# EAGLE design Main (EAGLE 6.3)
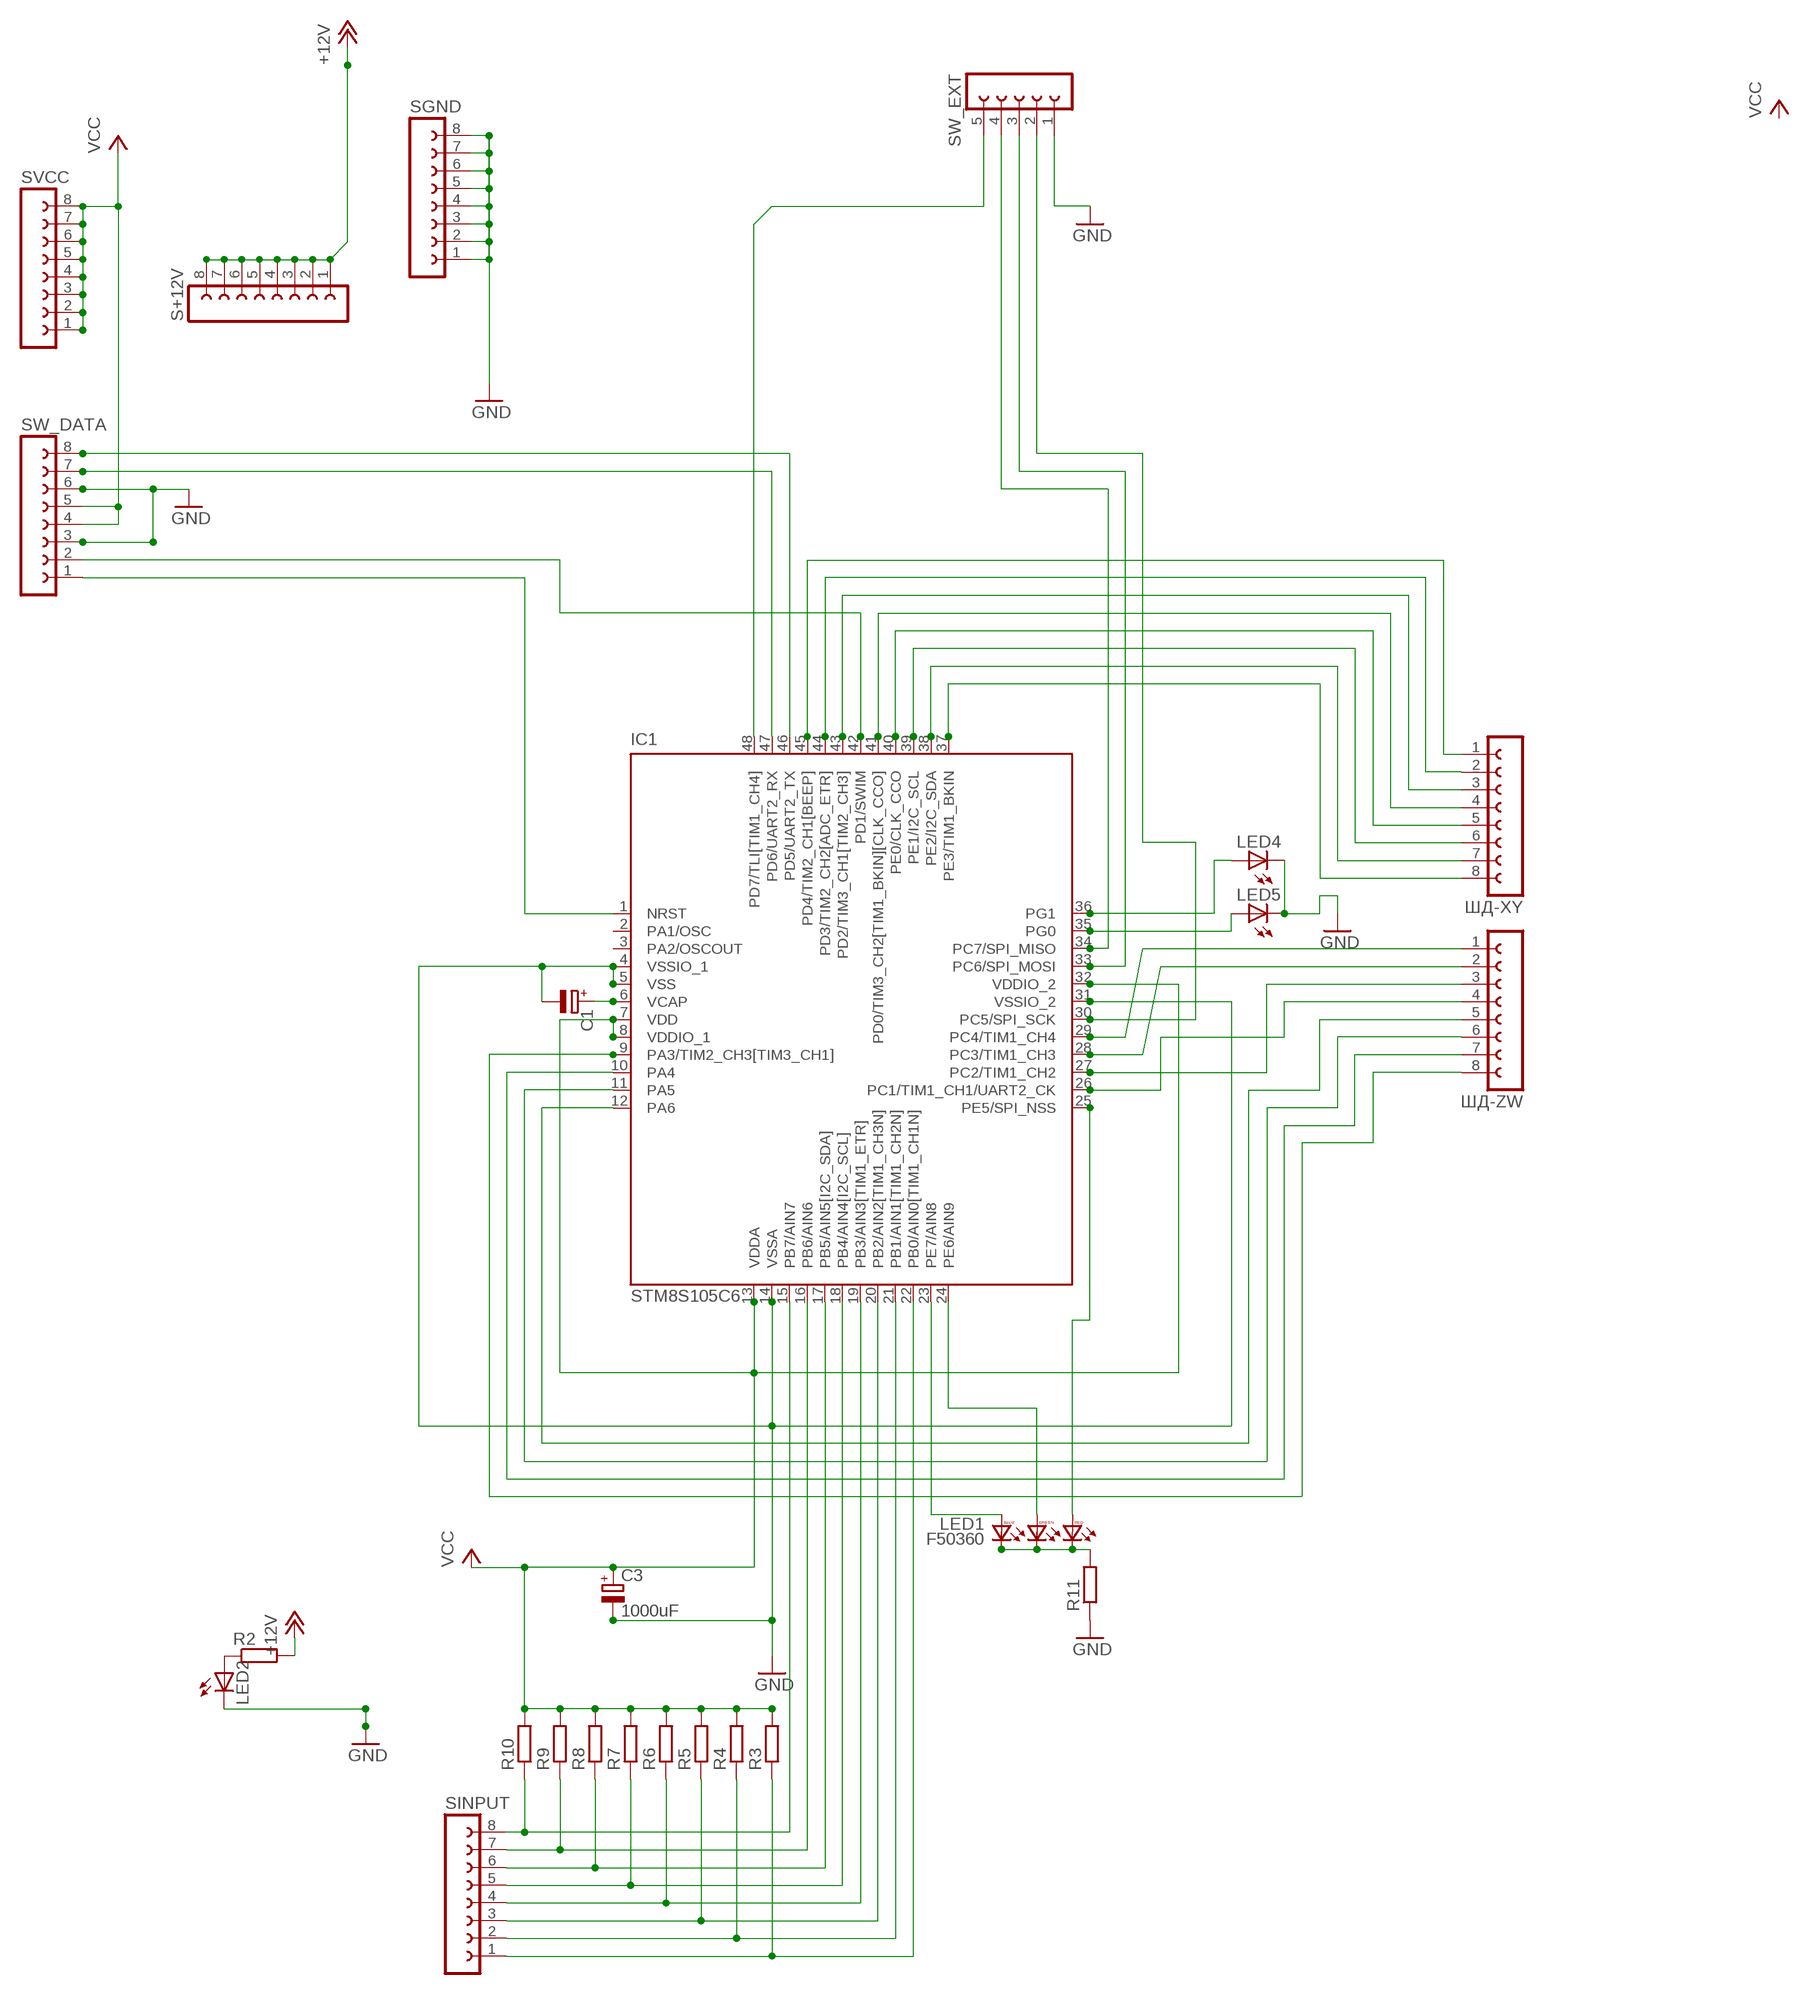
[diagram p0: schematic, sheet 1]

## Parts
C1  CPOL-EUR/2012-12W  [R/2012-12W]
C3  1000uF  CPOL-EUSANYO_9E  [SANYO-OSCON_9E]
IC1  STM8S105C6  [LQFP48-7X7]
LED1  F50360  [F50360]
LED2  LED3MM  [LED3MM]
LED4  LED3MM  [LED3MM]
LED5  LED3MM  [LED3MM]
R2  R-EU_0204/7  [0204/7]
R3  R-EU_M0805  [M0805]
R4  R-EU_M0805  [M0805]
R5  R-EU_M0805  [M0805]
R6  R-EU_M0805  [M0805]
R7  R-EU_M0805  [M0805]
R8  R-EU_M0805  [M0805]
R9  R-EU_M0805  [M0805]
R10  R-EU_M0805  [M0805]
R11  R-EU_0204/7  [0204/7]
S+12V  FE08-1  [FE08]
SGND  FE08-1  [FE08]
SINPUT  FE08-1  [FE08]
SVCC  FE08-1  [FE08]
SW_DATA  FE08-1  [FE08]
SW_EXT  FE05-1  [FE05-1]
ШД-XY  FE08-1  [FE08]
ШД-ZW  FE08-1  [FE08]

## Nets
+12V: R2.2 S+12V.1 S+12V.2 S+12V.3 S+12V.4 S+12V.5 S+12V.6 S+12V.7 S+12V.8
GND: C1.- C3.- IC1.4(VSSIO_1) IC1.5(VSS) IC1.14(VSSA) IC1.31(VSSIO_2) LED2.K(C) LED4.K(C) LED5.K(C) R11.1 SGND.1 SGND.2 SGND.3 SGND.4 SGND.5 SGND.6 SGND.7 SGND.8 SW_DATA.3 SW_DATA.6 SW_EXT.1
IN-Y3: IC1.45(PD4/TIM2_CH1[BEEP]) ШД-XY.1
IN-Y4: IC1.43(PD2/TIM3_CH1[TIM2_CH3]) ШД-XY.3
LED_GND: LED1.BC LED1.GC LED1.RC R11.2
N$1: IC1.22(PB0/AIN0[TIM1_CH1N]) R3.1 SINPUT.1
N$6: IC1.47(PD6/UART2_RX) SW_DATA.7
N$7: C1.+ IC1.6(VCAP)
N$13: IC1.40(PE0/CLK_CCO) ШД-XY.5
N$14: IC1.39(PE1/I2C_SCL) ШД-XY.6
N$15: IC1.38(PE2/I2C_SDA) ШД-XY.7
N$16: IC1.37(PE3/TIM1_BKIN) ШД-XY.8
N$18: IC1.34(PC7/SPI_MISO) SW_EXT.4
N$19: IC1.35(PG0) LED5.A
N$20: IC1.26(PC1/TIM1_CH1/UART2_CK) ШД-ZW.4
N$21: IC1.9(PA3/TIM2_CH3[TIM3_CH1]) ШД-ZW.8
N$22: IC1.27(PC2/TIM1_CH2) ШД-ZW.3
N$23: IC1.11(PA5) ШД-ZW.6
N$24: IC1.12(PA6) ШД-ZW.5
N$25: IC1.28(PC3/TIM1_CH3) ШД-ZW.2
N$26: IC1.41(PD0/TIM3_CH2[TIM1_BKIN][CLK_CCO]) ШД-XY.4
N$27: IC1.29(PC4/TIM1_CH4) ШД-ZW.1
N$28: IC1.30(PC5/SPI_SCK) SW_EXT.2
N$29: IC1.36(PG1) LED4.A
N$35: IC1.21(PB1/AIN1[TIM1_CH2N]) R4.1 SINPUT.2
N$36: IC1.20(PB2/AIN2[TIM1_CH3N]) R5.1 SINPUT.3
N$38: IC1.19(PB3/AIN3[TIM1_ETR]) R6.1 SINPUT.4
N$41: IC1.18(PB4/AIN4[I2C_SCL]) R7.1 SINPUT.5
N$42: IC1.17(PB5/AIN5[I2C_SDA]) R8.1 SINPUT.6
N$43: IC1.16(PB6/AIN6) R9.1 SINPUT.7
N$44: IC1.15(PB7/AIN7) R10.1 SINPUT.8
N$46: IC1.23(PE7/AIN8) LED1.BA
N$47: IC1.24(PE6/AIN9) LED1.GA
N$48: IC1.25(PE5/SPI_NSS) LED1.RA
N$49: IC1.48(PD7/TLI[TIM1_CH4]) SW_EXT.5
N$50: IC1.33(PC6/SPI_MOSI) SW_EXT.3
N$52: IC1.10(PA4) ШД-ZW.7
N$54: IC1.44(PD3/TIM2_CH2[ADC_ETR]) ШД-XY.2
N$60: LED2.A R2.1
RST: IC1.1(NRST) SW_DATA.1
SWD: IC1.42(PD1/SWIM) SW_DATA.2
TXD: IC1.46(PD5/UART2_TX) SW_DATA.8
VCC: C3.+ IC1.7(VDD) IC1.8(VDDIO_1) IC1.13(VDDA) IC1.32(VDDIO_2) R3.2 R4.2 R5.2 R6.2 R7.2 R8.2 R9.2 R10.2 SVCC.1 SVCC.2 SVCC.3 SVCC.4 SVCC.5 SVCC.6 SVCC.7 SVCC.8 SW_DATA.4 SW_DATA.5
Unconnected: IC1.2(PA1/OSC) IC1.3(PA2/OSCOUT)

## Library data of the parts
C1 = resistor:CPOL-EU: POLARIZED CAPACITOR, European symbol
C3 = rcl:CPOL-EU: POLARIZED CAPACITOR, European symbol
IC1 = st-microelectronics:STM8S105C: Access line, 16 MHz STM8S 8-bit MCU up to 32 Kbytes Flash, integrated EEPROM,10-bit ADC, timers, UART, SPI, I²C Source: Data sheet <http://www.st.com/stonline/products/literature/ds/14771/stm8s105c4.pdf>; MPN: STM8S105C6T6; OC_FARNELL: 1706222; OC_NEWARK: 09R6033
LED1 = led:F50360: Full color Z-Power LED RGB P5-II Series Source: http://www.seoulsemicon.co.kr .. F50360.pdf
LED2 LED4 LED5 = led:LED: LED OSRAM: - CHIPLED LG R971, LG N971, LY N971, LG Q971, LY Q971, LO R971, LY R971 LH N974, LH R974 LS Q976, LO Q976, LY Q976 LO Q996 - Hyper CHIPLED LW Q18S LB Q993, LB Q99A, LB R99A - SideLED LS A670, LO A670, LY A670, LG A670, LP A670 LB A673, LV A673, LT A673, LW A673 LH A674 LY A675 LS A676, LA A676, LO A676, LY A676, LW A676 LS A679, LY A679, LG A679 - Hyper Micro SIDELED® LS Y876, LA Y876, LO Y876, LY Y876 LT Y87S - SmartLED LW L88C, LW L88S LB L89C, LB L89S, LG L890 LS L89K, LO L89K, LY L89K LS L896, LA L896, LO L896, LY L896 - TOPLED LS T670, LO T670, LY T670, LG T670, LP T670 LSG T670, LSP T670, LSY T670, LOP T670, LYG T670 LG T671, LOG T671, LSG T671 LB T673, LV T673, LT T673, LW T673 LH T674 LS T676, LA T676, LO T676, LY T676, LB T676, LH T676, LSB T676, LW T676 LB T67C, LV T67C, LT T67C, LS T67K, LO T67K, LY T67K, LW E67C LS E67B, LA E67B, LO E67B, LY E67B, LB E67C, LV E67C, LT E67C LW T67C LS T679, LY T679, LG T679 LS T770, LO T770, LY T770, LG T770, LP T770 LB T773, LV T773, LT T773, LW T773 LH T774 LS E675, LA E675, LY E675, LS T675 LS T776, LA T776, LO T776, LY T776, LB T776 LHGB T686 LT T68C, LB T68C - Hyper Mini TOPLED® LB M676 - Mini TOPLED Santana® LG M470 LS M47K, LO M47K, LY M47K Source: http://www.osram.convergy.de LUXEON: - LUMILED® LXK2-PW12-R00, LXK2-PW12-S00, LXK2-PW14-U00, LXK2-PW14-V00 LXK2-PM12-R00, LXK2-PM12-S00, LXK2-PM14-U00 LXK2-PE12-Q00, LXK2-PE12-R00, LXK2-PE12-S00, LXK2-PE14-T00, LXK2-PE14-U00 LXK2-PB12-K00, LXK2-PB12-L00, LXK2-PB12-M00, LXK2-PB14-N00, LXK2-PB14-P00, LXK2-PB14-Q00 LXK2-PR12-L00, LXK2-PR12-M00, LXK2-PR14-Q00, LXK2-PR14-R00 LXK2-PD12-Q00, LXK2-PD12-R00, LXK2-PD12-S00 LXK2-PH12-R00, LXK2-PH12-S00 LXK2-PL12-P00, LXK2-PL12-Q00, LXK2-PL12-R00 Source: www.luxeon.com KINGBRIGHT: KA-3528ASYC Source: www.kingbright.com
R2-R11 = resistor:R-EU_: RESISTOR, European symbol
S+12V SGND SINPUT SVCC SW_DATA ШД-XY ШД-ZW = con-lsta:FE08-1: FEMALE HEADER; OC_FARNELL: unknown; OC_NEWARK: unknown
SW_EXT = con-lsta:FE05-1: FEMALE HEADER; OC_FARNELL: unknown; OC_NEWARK: unknown

## Board
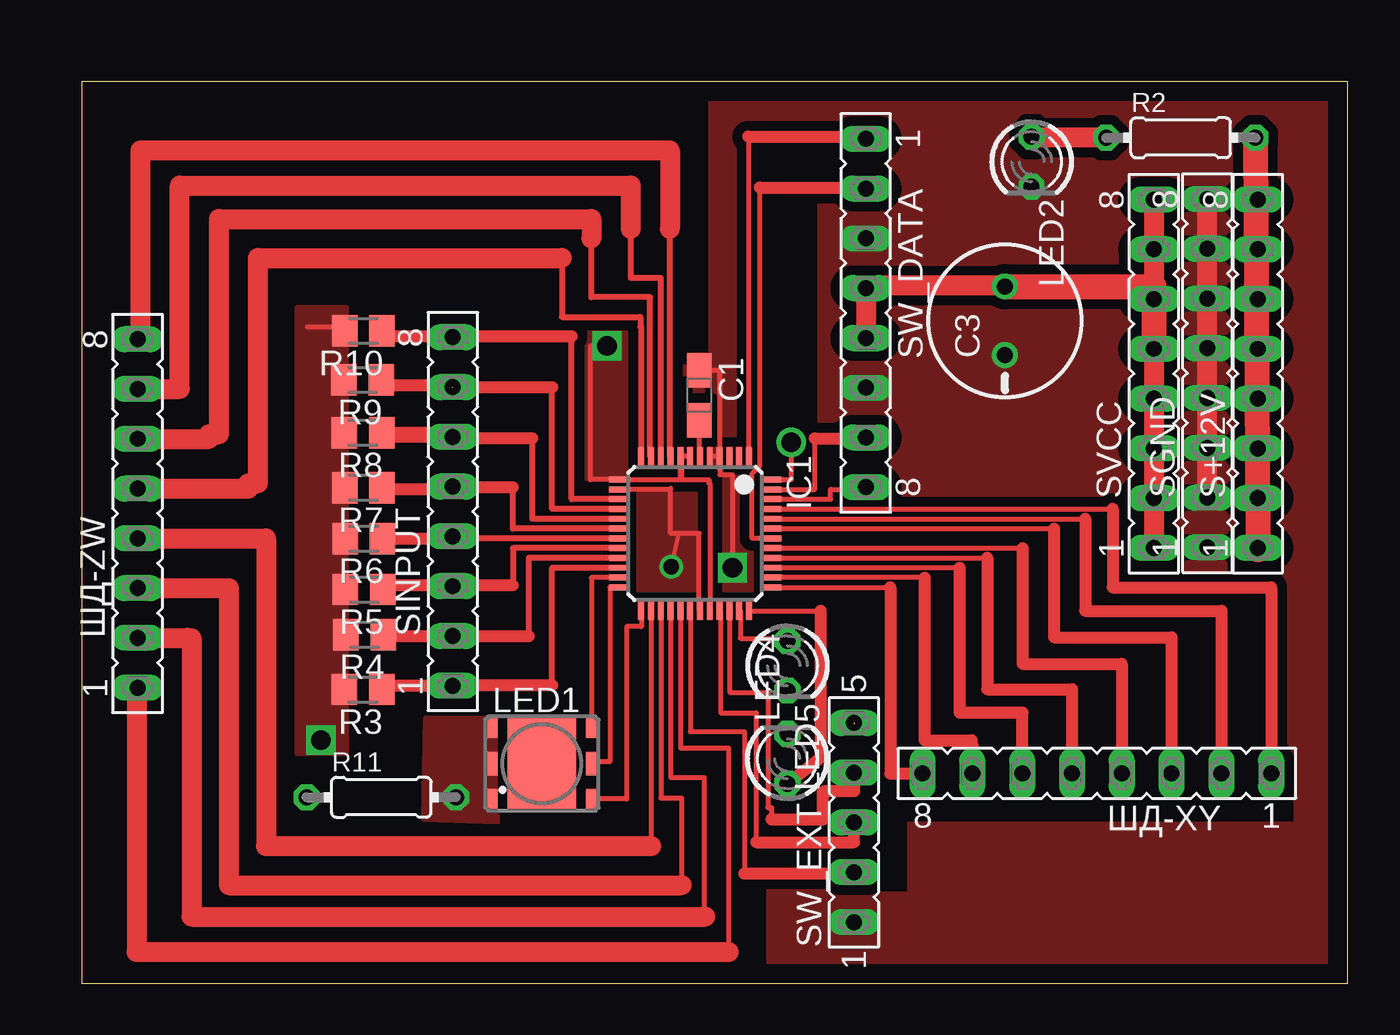
[diagram p1: board, top side]
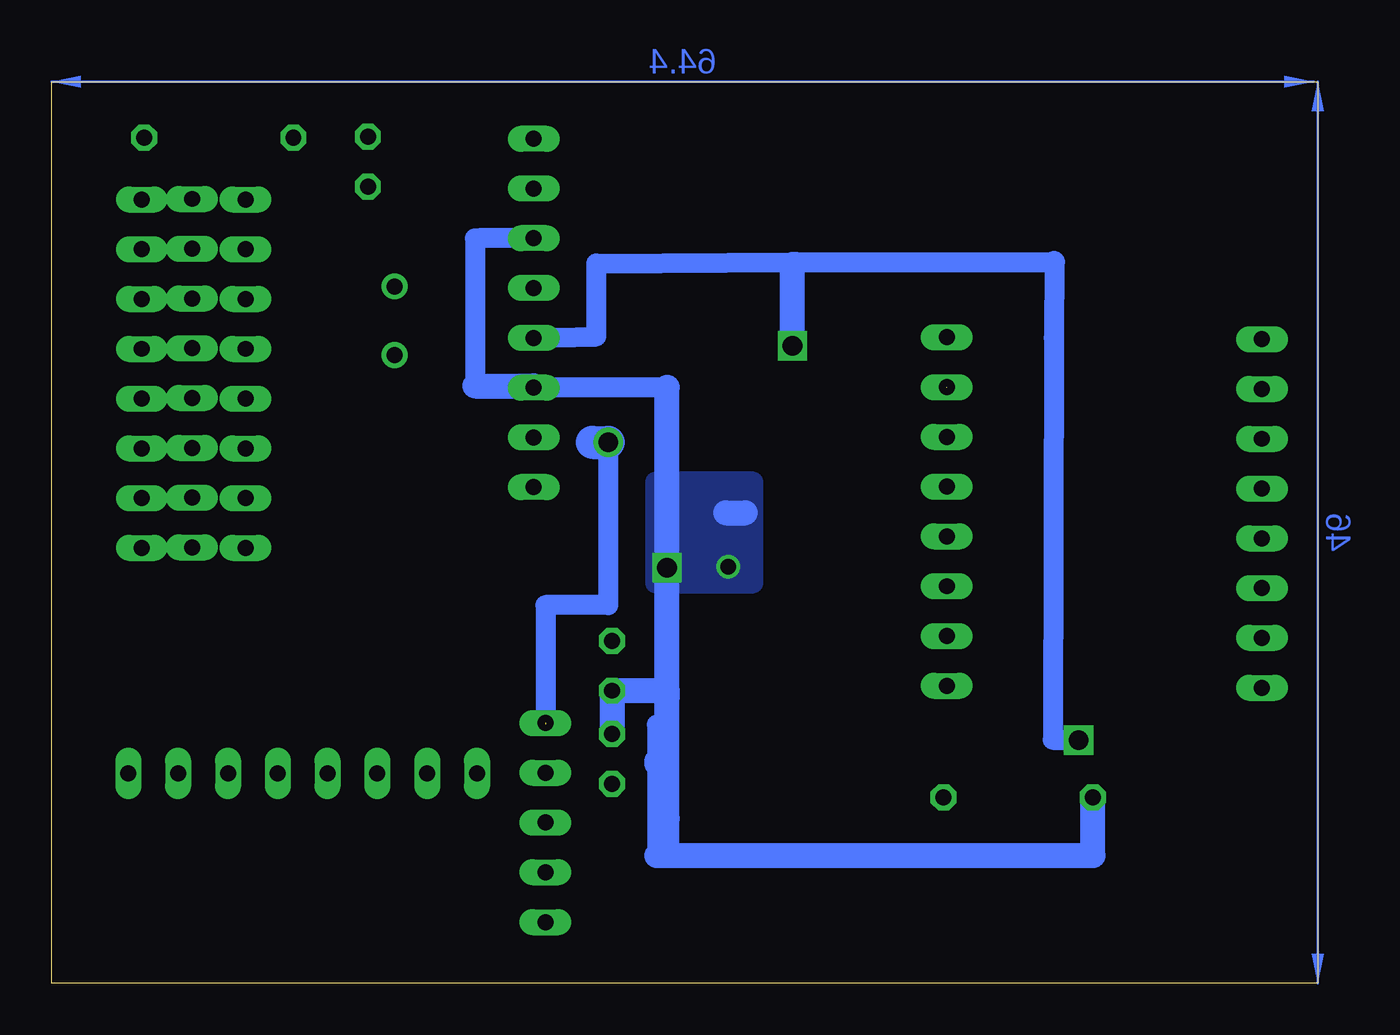
[diagram p2: board, bottom side, seen from below]

Size 64.6 x 46 mm. Coordinates in mm from the lower left corner, seen from the top.
Outline: 0,0 64.6,0 64.6,46 0,46 0,0
Copper layers (1*16): Top 0.035mm / dielectric 1.5mm / Bottom 0.035mm
Design rules "default *": minimum track width 0.2mm, minimum drill 0.8mm, track to track 0.5mm, track to pad 0.5mm, pad to pad 0.5mm, via to via 0.5mm, smd to smd 0.1mm, copper to edge 1mm, drill to drill 1mm, minimum pad ring 10mil, minimum via ring 8mil, stop-mask expansion 4mil, vias tented up to drill 0mil, thermal gap 0mil
tRestrict: area 10.4,8.1 to 16.4,11.2; area 41.7,8.2 to 61.8,9.6; area 33.8,1 to 34.9,4.8; area 0.7,1 to 1.5,45.4; area 1,43.4 to 30.9,45.4; area 30.8,32.2 to 32,45; area 35.2,28.7 to 37.5,39.9; area 40.7,4.7 to 42.1,9.7; area 33.7,15.5 to 35,16.8; area 35.4,11.4 to 37,16.4

### Footprints (pad centres in the part's own frame; a part is rotated, then mirrored left to right if it is on the bottom)
R/2012-12W = smd 1.75 x 1.26: + 1.275,0; - -1.275,0
SANYO-OSCON_9E = drill 0.8 pad 1.27: + 1.75,0; - -1.75,0
LQFP48-7X7 = smd 0.9 x 0.3: 1 -3.95,2.75; 2 -3.95,2.25; 3 -3.95,1.75; 4 -3.95,1.25; 5 -3.95,0.75; 6 -3.95,0.25; 7 -3.95,-0.25; 8 -3.95,-0.75; 9 -3.95,-1.25; 10 -3.95,-1.75; 11 -3.95,-2.25; 12 -3.95,-2.75; 25 3.95,-2.75; 26 3.95,-2.25; 27 3.95,-1.75; 28 3.95,-1.25; 29 3.95,-0.75; 30 3.95,-0.25; 31 3.95,0.25; 32 3.95,0.75; 33 3.95,1.25; 34 3.95,1.75; 35 3.95,2.25; 36 3.95,2.75 | smd 0.3 x 0.9: 13 -2.75,-3.95; 14 -2.25,-3.95; 15 -1.75,-3.95; 16 -1.25,-3.95; 17 -0.75,-3.95; 18 -0.25,-3.95; 19 0.25,-3.95; 20 0.75,-3.95; 21 1.25,-3.95; 22 1.75,-3.95; 23 2.25,-3.95; 24 2.75,-3.95; 37 2.75,3.95; 38 2.25,3.95; 39 1.75,3.95; 40 1.25,3.95; 41 0.75,3.95; 42 0.25,3.95; 43 -0.25,3.95; 44 -0.75,3.95; 45 -1.25,3.95; 46 -1.75,3.95; 47 -2.25,3.95; 48 -2.75,3.95
F50360 = smd 0.6 x 1.05: BA 2.55,1.825; BC -2.55,1.825; RA 2.55,-1.825; RC -2.55,-1.825 | smd 0.6 x 1.2: GA 2.55,0; GC -2.55,0 | smd 3.5 x 4.7: NC 0,0
LED3MM = drill 0.813 octagon: A -1.27,0; K 1.27,0
0204/7 = drill 0.813 octagon: 1 -3.81,0; 2 3.81,0
M0805 = smd 1.3 x 1.6: 1 -0.95,0; 2 0.95,0
FE08 = drill 0.813 long: 1 -8.89,0; 2 -6.35,0; 3 -3.81,0; 4 -1.27,0; 5 1.27,0; 6 3.81,0; 7 6.35,0; 8 8.89,0
FE05-1 = drill 0.813 long: 1 -5.08,0; 2 -2.54,0; 3 0,0; 4 2.54,0; 5 5.08,0

### Placement (x,y rotation side)
C1  31.5,30 270 top
C3  47.1,33.8 90 top
IC1  31.29,22.95 270 top
LED1  23.47,11.21 0 top
LED2  48.46,41.92 270 top
LED4  36,11.45 90 top
LED5  36,16.2 270 top
R2  56.07,43.14 0 top
R3  14.35,14.99 180 top
R4  14.43,17.79 180 top
R5  14.41,20.09 180 top
R6  14.39,22.69 180 top
R7  14.37,25.29 180 top
R8  14.35,28.09 180 top
R9  14.33,30.79 180 top
R10  14.37,33.29 180 top
R11  15.28,9.49 0 top
S+12V  60,31.1 90 top
SGND  57.43,31.13 90 top
SINPUT  18.93,24.07 90 top
SVCC  54.7,31.1 90 top
SW_DATA  40,34.2 270 top
SW_EXT  39.4,8.2 90 top
ШД-XY  51.79,10.71 180 top
ШД-ZW  2.85,23.97 90 top

### Tracks (layer width: path | path; a pad name or v marks a point on that pad's centre or on a via)
+12V
  Top 0.2: S+12V.2 59.96,24.88 60,24.88 | 60,32.5 59.96,32.5 S+12V.5 | S+12V.3 59.96,27.42 60,27.42 | S+12V.4 59.96,29.96 60,29.96 | S+12V.6 59.96,35.04 60,35.04 | S+12V.7 59.96,37.58 60,37.58 | 59.96,22.34 S+12V.1
  Top 1.016: S+12V.8 60,37.58 S+12V.7 60,35.04 S+12V.6 60,32.5 S+12V.5 60,29.96 S+12V.4 60,27.42 S+12V.3 60,24.88 S+12V.2 S+12V.1
  Top 1.27: R2.2 60,22.12 S+12V.1
GND  (via drill 0.8, 1)
  Top 0.2: SGND.2 57.42,24.88 57.43,24.88 | SGND.3 57.42,27.42 57.43,27.42 | SGND.4 57.42,29.96 57.43,29.96 | SGND.5 57.42,32.5 57.43,32.5 | SGND.6 57.42,35.04 57.43,35.04 | SGND.7 57.42,37.58 57.43,37.58 | 31.75,31.75 C1.- | v30.08,21.26 30.48,22.95
  Top 0.254: IC1.5 IC1.4 | IC1.4 | 32.6,26.9 IC1.4 | IC1.4 32.55,25.95 33.2,25.95 v33.2,21.2 | C1.- 32.54,31.27 IC1.4 | IC1.31 31.5,19 31.5,22.95 30.48,22.95 30.05,22.95 30.05,25.2 | 30.05,25.25 30.05,25.2 | 30.05,25.2 IC1.14
  Top 1.016: SGND.2 57.43,24.88 SGND.3 57.43,27.42 SGND.4 57.43,29.96 SGND.5 57.43,32.5 SGND.6 57.43,35.04 SGND.7 57.43,37.58 SGND.8
  Bottom 0.2: 39.37,30.4 39.37,30.48 SW_DATA.6 40.64,30.48 | 57.42,22.34 SGND.1 | 43.18,30.48 43,30.48
  Bottom 1.016: 11.4,9.49 R11.1 11.4,9.42 11.4,6.6 11.48,6.52 | SW_DATA.6 39.37,30.4 33.2,30.4 v33.2,21.2 33.2,14.6 | 33.2,8.4 33.2,6.4 33.6,6.4 33.72,6.52 33.72,11.2 33.72,13.2 | SW_DATA.3 42.8,38.01 42.8,38 43,38 43,30.48 43,30.39
  Bottom 1.27: 30.2,24 29.2,24 | 33.2,20.6 v33.2,21.2 | 43,30.48 40,30.48 SW_DATA.6 | 33.2,6.52 11.47,6.52 R11.1 | 33.72,6.52 33.2,6.52 | 33.2,6.52 33.2,8.4 33.2,14.6 33.2,14.93 | 33.2,14.93 33.2,30.4 | 33.72,11.33 33.72,11.2 | LED4.K LED5.K 33.2,14.93
  pour Bottom (no thermals): 28.8,25.6 33.8,25.6 33.8,20.4 28.8,20.4
  pour Top: 32.6,25.2 34.2,25.2 34.2,20.2 32.6,20.2
  pour Top: 28.4,20 28.4,20.4 28.4,25.2 31.4,25.2 31.4,20
  pour Top: 0.2,46 64.6,46 64.6,-0.2 0,-0.2 0,0 0,46
IN-Y3
  Top 0.254: IC1.45 52.6,24.2
  Top 0.61: ШД-XY.1 60.68,20.2 52.6,20.2 52.6,24.2
IN-Y4
  Top 0.254: IC1.43 49.6,23.2
  Top 0.61: 49.6,23.2 49.6,17.65 55.6,17.65 ШД-XY.3
LED_GND
  pour Top (no thermals): 17.45,8.35 17.55,13.55 21.25,13.55 21.2,8.2
N$1
  Top 0.305: 24,15.2 24,21.2 IC1.22 | 18.93,15.2 SINPUT.1
  Top 0.61: 24,15.2 18.93,15.2 | SINPUT.1 15.3,15.18 R3.1
N$6
  Top 0.254: IC1.47 37.4,25.2 37.4,27.8 | 40,27.8 SW_DATA.7
  Top 0.61: 37.4,27.8 40,27.8
N$7
  Top 0.254: C1.+ 31.5,26.94 IC1.6
N$13
  Top 0.254: IC1.40 46.2,21.7
  Top 0.61: 46.2,21.7 46.2,15 50.52,15 ШД-XY.5
N$14
  Top 0.254: 44.8,21.2 IC1.39 | ШД-XY.6 48,10.71
  Top 0.61: 48,10.71 48,13.8 44.8,13.8 44.8,21.2
N$15
  Top 0.254: 43,20.7 IC1.38 | 45.4,12.2 45.44,12.2
  Top 0.61: 43,20.7 43,12.4 45.4,12.4 45.4,12.2 | 45.44,12.2 ШД-XY.7
N$16
  Top 0.254: IC1.37 41.25,20.2 | ШД-XY.8
  Top 0.61: 41.25,20.2 41.25,10.7 ШД-XY.8
N$18
  Top 0.254: IC1.34 33.05,14.85 35,14.85 35,8.95 35.2,8.95 35.2,8.4
  Top 0.61: SW_EXT.4 39.4,9.8 37.9,9.8 37.9,9.75 37.8,9.75 37.8,8.35 35.2,8.35 35.2,8.4
N$19
  Top 0.254: IC1.35 33.6,19 33.6,17.6 36,17.6 LED5.A
N$20
  Top 0.254: IC1.26 29.05,7
  Top 1.016: ШД-ZW.4 9.4,22.7 9.4,7 29.05,7
N$21
  Top 0.305: IC1.9 30,26.9 30,38.5
  Top 1.016: ШД-ZW.8 3,32.86 3,42.5 30,42.5 30,38.5
N$22
  Top 0.254: IC1.27 29.55,9.45 30.6,9.45 30.6,5
  Top 1.016: ШД-ZW.3 7.5,20.16 7.5,5 30.6,5
N$23
  Top 0.305: IC1.11 29,26.9 29,35 26,35 26,38
  Top 1.016: ШД-ZW.6 6.5,27.78 6.5,28 7,28 7,39 26,39 26,38
N$24
  Top 0.305: 24.5,37 24.5,34 28.5,34 28.5,33.5 28.54,33.5 IC1.12
  Top 1.016: ШД-ZW.5 8.5,25.24 8.5,25.5 9,25.5 9,37 24.5,37
N$25
  Top 0.254: 31.8,3.4 31.75,3.4 31.75,10.5 30.05,10.5 IC1.28
  Top 1.016: ШД-ZW.2 5.4,17.62 5.4,17.6 5.6,17.6 5.6,3.4 31.8,3.4
N$26
  Top 0.254: IC1.41 48,22.2
  Top 0.61: 48,22.2 48,16.3 53.06,16.3 ШД-XY.4
N$27
  Top 0.254: IC1.29 30.55,12 33,12 33,1.6
  Top 1.016: ШД-ZW.1 2.8,15.08 2.8,1.6 33,1.6
N$28
  Top 0.254: IC1.30 31.05,12.85 33.8,12.85 33.8,5.6 | 39.4,5.6 SW_EXT.2
  Top 0.61: 33.8,5.6 39.4,5.6
N$29
  Top 0.254: IC1.36 37.7,19
  Top 0.61: 37.7,19 37.7,11.5 LED4.A
N$35
  Top 0.305: IC1.21 22.8,21.7 22.8,17.7 | 18.93,17.7 SINPUT.2
  Top 0.61: 22.8,17.7 18.93,17.7 15.38,17.7 R4.1
N$36
  Top 0.305: IC1.20 22,22.2 22,20.3 | 18.93,20.3 SINPUT.3
  Top 0.61: 22,20.3 18.93,20.3 15.36,20.3 R5.1
N$38
  Top 0.254: 18.93,22.69 SINPUT.4
  Top 0.305: IC1.19 18.93,22.7 SINPUT.4
  Top 0.61: R6.1 18.93,22.69
N$41
  Top 0.254: 18.93,25.19 SINPUT.5 | 15.32,25.19 R7.1
  Top 0.305: IC1.18 22,23.2 22,25.3 | 18.93,25.3 SINPUT.5
  Top 0.61: 22,25.3 18.93,25.3 | 18.93,25.19 15.32,25.19
N$42
  Top 0.305: IC1.17 23,23.7 23,27.8 | 18.93,27.8 SINPUT.6
  Top 0.61: 23,27.8 18.93,27.8 | 15.2,27.88 SINPUT.6 18.93,28.09 R8.1
N$43  (1 unrouted)
  Top 0.254: 19.5,30.5 19.5,30.4
  Top 0.305: IC1.16 24,24.2 24,30.4
  Top 0.61: 24,30.4 19.5,30.4 18.93,30.4 | 19.5,30.5 15.28,30.5 R9.1
N$44
  Top 0.305: IC1.15 25,24.7 25,33 | 18.93,33 SINPUT.8
  Top 0.61: 25,33 18.93,33 15.32,33 R10.1
N$46
  Top 0.254: IC1.23 26,20.7 26,13.05 LED1.BA
N$47
  Top 0.254: IC1.24 26.95,20.2 26.95,11.3 26.02,11.3 LED1.GA
N$48
  Top 0.254: IC1.25 28.55,18.2 27.8,18.2 27.8,9.4 LED1.RA
N$49  (via drill 1)  (1 unrouted)
  Top 0.254: IC1.48 36.2,25.7 v36.2,27.6
  Bottom 1.016: v36.2,27.6 36.2,19.3 39.4,19.3 39.4,13.2
  Bottom 1.676: 37,27.6 v36.2,27.6
N$50
  Top 0.254: IC1.33 32.6,19 32.6,13.8 34.4,13.8 34.4,7.2
  Top 0.61: 34.4,7.2 39.4,7.2 SW_EXT.3
N$52
  Top 0.305: 28,38.5 28,36 29.54,36 IC1.10
  Top 1.016: ШД-ZW.7 5,30.32 5,40.7 28,40.7 28,38.5
N$54
  Top 0.254: IC1.44 51.2,23.7
  Top 0.61: 51.2,23.7 51.2,19 58.14,19 ШД-XY.2
N$60
  Top 1.016: R2.1 48.6,43.14 | 48.6,43.14 48.6,43.2 | 48.6,43.14 48.46,43.14 LED2.A
RST
  Top 0.254: IC1.1 34.04,43.16 34,43.2 | 39.89,43.2 SW_DATA.1
  Top 0.61: 34,43.2 39.89,43.2
SWD
  Top 0.254: IC1.42 34.2,22.7 34.2,26 34.6,26.4 34.6,40.6 | 39.95,40.6 SW_DATA.2
  Top 0.61: 34.6,40.6 39.95,40.6
TXD
  Top 0.254: IC1.46 38.2,24.7 38.2,25.2 40,25.2 SW_DATA.8
VCC  (via drill 1)
  Top 0.2: SVCC.2 54.88,24.88 54.7,24.88 | 54.7,29.96 54.88,29.96 SVCC.4 | SVCC.3 54.88,27.42 54.7,27.42 | SVCC.6 54.88,35.04 54.7,35.04 | SVCC.7 54.88,37.58 54.7,37.58
  Top 0.254: 30.54,25.7 IC1.13 25.95,25.7 25.95,32.53 v26.8,32.53 | 30.54,25.7 IC1.8 IC1.7 | IC1.7 31,26.9 | 30.54,25.7 30.6,25.7 | 30.6,25.7 32,25.7 32,25.5 32.04,25.5 IC1.32 | IC1.7 30.6,26.9 30.6,25.7 | 11.5,33.5 13.22,33.5 R10.2
  Top 1.016: SVCC.8 54.7,37.58 SVCC.7 54.7,35.55 54.7,35.04 SVCC.6 SVCC.4 54.7,27.42 SVCC.3 54.7,24.88 SVCC.2 SVCC.1 | SVCC.5 54.7,29.96 | SW_DATA.5 SW_DATA.4 40,35.6 47.1,35.6 C3.+
  Top 1.27: C3.+ 54.7,35.55 SVCC.5
  Bottom 0.254: 26.8,36.2 26.6,36.2 26.6,36.8
  Bottom 1.016: SW_DATA.5 36.8,33 36.8,36.73 26.8,36.8 26.6,36.8 13.4,36.8 13.45,36.85 13.47,32.93 13.52,12.42 12.2,12.42 v12.2,12.4
  Bottom 1.27: v26.8,32.53 26.8,36.2
  pour Top (no thermals): 11,34.5 13.5,34.5 13.5,11.7 11,11.7
  pour Top: 25.8,33.2 27.8,33.2 27.8,25.8 25.8,25.8
(copper drawn outside any net)
  shapes: Bottom area x2